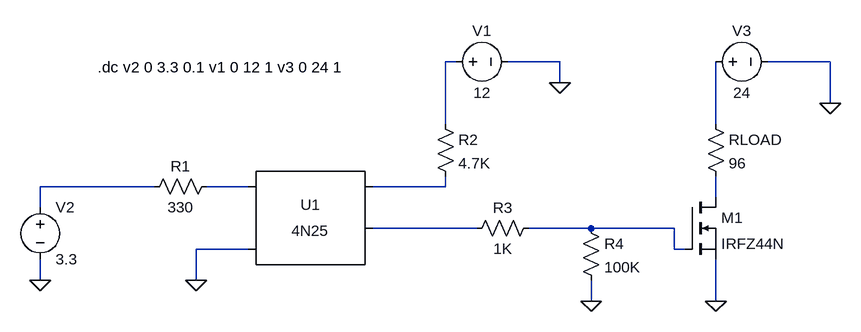
[diagram p0: schematic main.asc]
main.asc, the LTspice schematic file:
Version 4
SHEET 1 1156 680
WIRE 448 -80 432 -80
WIRE 608 -80 528 -80
WIRE 1024 -80 928 -80
WIRE 608 -48 608 -80
WIRE 1024 -16 1024 -80
WIRE 432 16 432 -80
WIRE 848 16 848 -80
WIRE -16 112 -192 112
WIRE 128 112 64 112
WIRE 432 112 432 96
WIRE 432 112 320 112
WIRE 848 128 848 96
WIRE -192 144 -192 112
WIRE 480 176 320 176
WIRE 656 176 560 176
WIRE 784 176 656 176
WIRE 128 208 48 208
WIRE 784 208 784 176
WIRE 800 208 784 208
WIRE -192 256 -192 224
WIRE 48 256 48 208
WIRE 656 288 656 256
WIRE 848 288 848 224
FLAG -192 256 0
FLAG 48 256 0
FLAG 656 288 0
FLAG 848 288 0
FLAG 608 -48 0
FLAG 1024 -16 0
SYMBOL Optos\\4N25 224 176 R0
SYMATTR InstName U1
SYMBOL res 80 96 R90
WINDOW 0 0 56 VBottom 2
WINDOW 3 32 56 VTop 2
SYMATTR InstName R1
SYMATTR Value 330
SYMBOL voltage 432 -80 R270
WINDOW 0 32 56 VTop 2
WINDOW 3 -32 56 VBottom 2
WINDOW 123 0 0 Left 0
WINDOW 39 0 0 Left 0
SYMATTR InstName V1
SYMATTR Value 12
SYMBOL voltage -192 128 R0
WINDOW 123 0 0 Left 0
WINDOW 39 0 0 Left 0
SYMATTR InstName V2
SYMATTR Value 3.3
SYMBOL res 416 0 R0
SYMATTR InstName R2
SYMATTR Value 4.7K
SYMBOL res 576 160 R90
WINDOW 0 0 56 VBottom 2
WINDOW 3 32 56 VTop 2
SYMATTR InstName R3
SYMATTR Value 1K
SYMBOL res 640 160 R0
SYMATTR InstName R4
SYMATTR Value 100K
SYMBOL res 832 0 R0
SYMATTR InstName RLOAD
SYMATTR Value 96
SYMBOL nmos 800 128 R0
SYMATTR InstName M1
SYMATTR Value IRFZ44N
SYMBOL voltage 832 -80 R270
WINDOW 0 32 56 VTop 2
WINDOW 3 -32 56 VBottom 2
WINDOW 123 0 0 Left 0
WINDOW 39 0 0 Left 0
SYMATTR InstName V3
SYMATTR Value 24
TEXT -104 -72 Left 2 !.dc v2 0 3.3 0.1 v1 0 12 1 v3 0 24 1

The netlist it stands for:
* main.asc
XU1 N004 0 N005 N007 NC_01 4N25
R1 N004 N003 330
V1 N001 0 12
V2 N003 0 3.3
R2 N001 N005 4.7K
R3 N008 N007 1K
R4 N008 0 100K
RLOAD N002 N006 96
M1 N006 N008 0 0 IRFZ44N
V3 N002 0 24
.model NMOS NMOS
.model PMOS PMOS
.lib standard.mos
.dc v2 0 3.3 0.1 v1 0 12 1 v3 0 24 1
.lib 4N25.sub
.backanno
.end